# EAGLE design relais platine v7 (EAGLE 6.1)
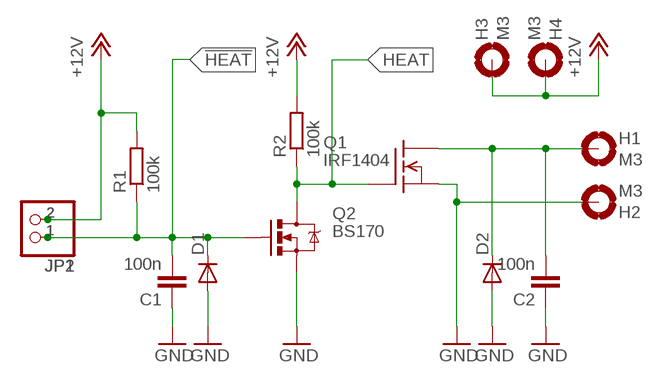
[diagram p0: schematic, sheet 1]

## Parts
C1  100n  C-EUC0805K  [C0805K]
C2  100n  C-EUC0805K  [C0805K]
D1  DIODE-MINIMELF  [MINIMELF]
D2  DIODE-MINIMELF  [MINIMELF]
H1  M3  MOUNT-PAD-ROUND3.0  [3,0-PAD]
H2  M3  MOUNT-PAD-ROUND3.0  [3,0-PAD]
H3  M3  MOUNT-PAD-ROUND3.0  [3,0-PAD]
H4  M3  MOUNT-PAD-ROUND3.0  [3,0-PAD]
JP1  PINHD-1X2  [1X02]
JP2  PINHD-1X2/90  [1X02/90]
Q1  IRF1404  IRF540  [TO220]
Q2  BS170  MOSFET-NCHANNELBSS123LT1G  [SOT23-3]
R1  100k  R-EU_M0805  [M0805]
R2  100k  R-EU_M0805  [M0805]

## Nets
!HEAT: C1.2 D1.C JP1.1 JP2.1 Q2.1(G) R1.1
+12V: H3.B3,0(MOUNT) H4.B3,0(MOUNT) JP1.2 JP2.2 R1.2 R2.2
GND: C1.1 C2.1 D1.A D2.A H2.B3,0(MOUNT) Q1.3(S) Q2.2(S)
HEAT: Q1.1(G) Q2.3(D) R2.1
HIGH: C2.2 D2.C H1.B3,0(MOUNT) Q1.2(D)

## Library data of the parts
C1 C2 = rcl:C-EU: CAPACITOR, European symbol
D1 D2 = diode:DIODE-: DIODE
H1-H4 = holes:MOUNT-PAD-ROUND: MOUNTING PAD, round
JP1 JP2 = pinhead:PINHD-1X2: PIN HEADER
Q1 = transistor-fet:IRF540: N-Channel Enhancement MOSFET (HEXFET); 100V; 28A; 0,077Ohm
Q2 = SparkFun-DiscreteSemi:MOSFET-NCHANNEL: Common NMOSFET Parts MFG P/N Store ID Prod ID FDD8780 TRANS-09984 SI7820DN TRANS-11055 FDS6630A IC-08089 2N7002PW TRANS-11151 FQP30N06L COM-10213 TRANS-10060 BSS123LT1G TRANS-08345 BSS138 TRANS-00830 BS170 2N7000; PROD_ID: TRANS-08345
R1 R2 = rcl:R-EU_: RESISTOR, European symbol

## Board
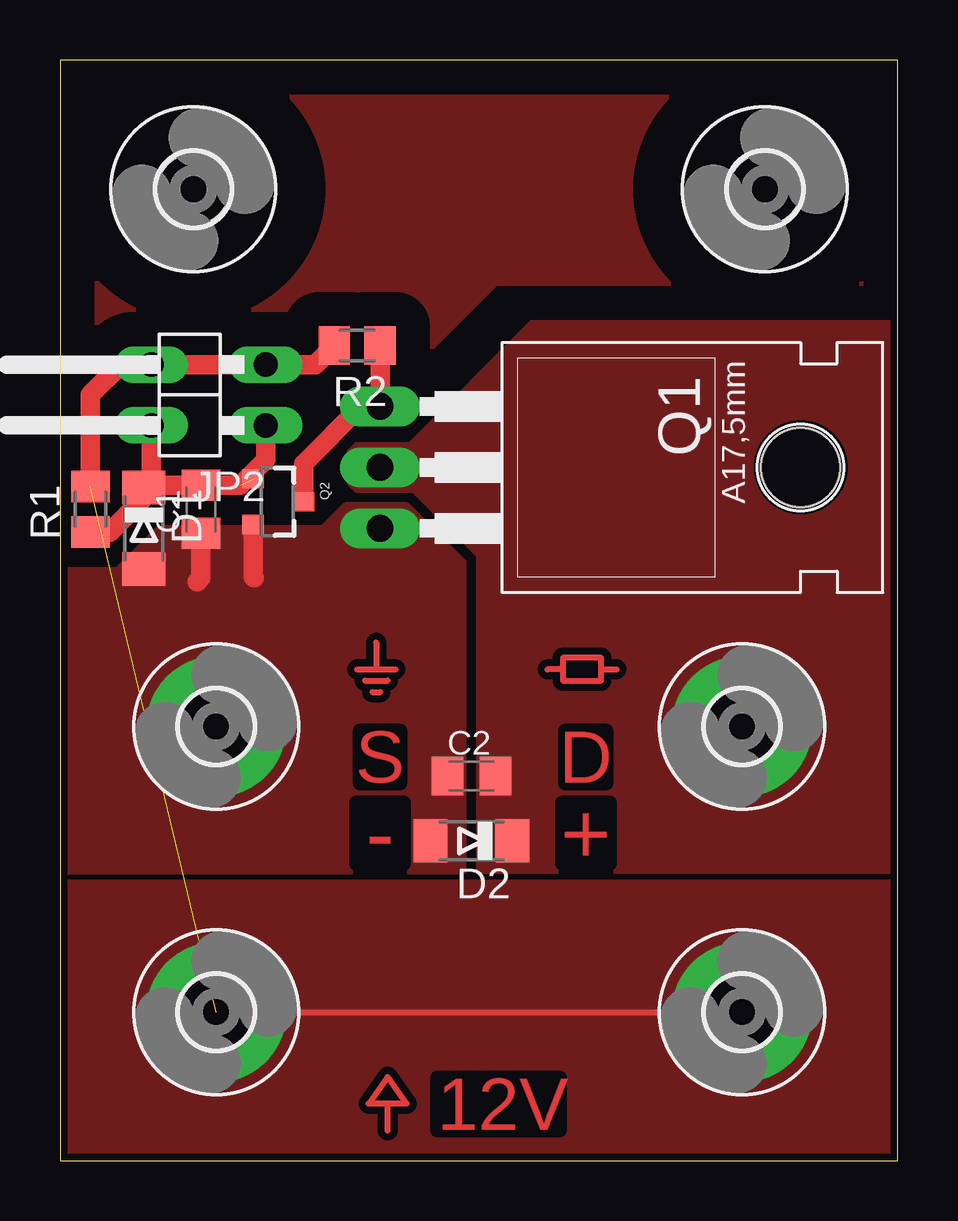
[diagram p1: board, top side]
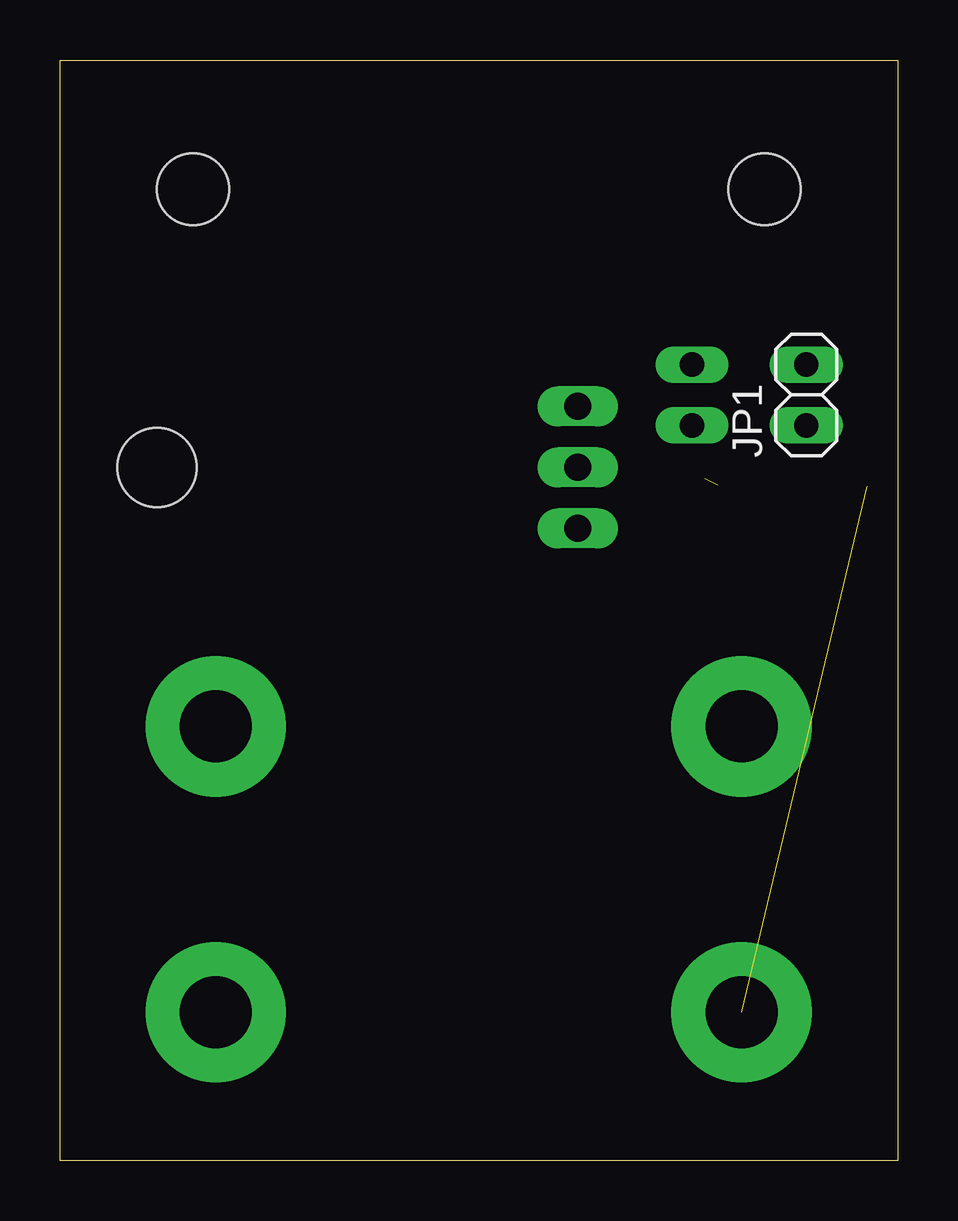
[diagram p2: board, bottom side, seen from below]

Size 34.91 x 45.87 mm. Coordinates in mm from the lower left corner, seen from the top.
Outline: 0,0 34.91,0 34.91,45.87 0,45.87 0,0
Copper layers (1*16): Top 0.035mm / dielectric 1.5mm / Bottom 0.035mm
Design rules: minimum track width 10mil, minimum drill 24mil, track to track 12mil, track to pad 12mil, pad to pad 12mil, via to via 12mil, smd to smd 10mil, copper to edge 12mil, drill to drill 12mil, minimum pad ring 10mil, minimum via ring 10mil, stop-mask expansion 4mil, vias tented up to drill 0mil, thermal gap 12mil

### Footprints (pad centres in the part's own frame; a part is rotated, then mirrored left to right if it is on the bottom)
C0805K = smd 1.3 x 1.6: 1 -1,0; 2 1,0
MINIMELF = smd 1.4 x 1.8: A 1.7,0; C -1.7,0
3,0-PAD = drill 3 pad 5.842: B3,0 0,0
1X02 = drill 1.016 long: 1 -1.27,0; 2 1.27,0
1X02/90 = drill 1.016 long: 1 -1.27,-3.81; 2 1.27,-3.81
TO220 = drill 1.118 long: 1 -2.54,-6.35; 2 0,-6.35; 3 2.54,-6.35 | hole 3.302: 0,11.176
SOT23-3 = smd 0.8 x 0.9: 1 -0.95,-1; 2 0.95,-1; 3 0,1.1
M0805 = smd 1.3 x 1.6: 1 -0.95,0; 2 0.95,0
3,0 = hole 3: 0,0

### Placement (x,y rotation side)
C1  5.87,27.15 90 top
C2  17.14,16.03 0 top
D1  3.49,26.35 270 top
D2  17.14,13.34 180 top
H1  28.42,18.1 0 top
H2  6.51,18.1 0 top
H3  28.42,6.19 0 top
H4  6.51,6.19 0 top
JP1  3.81,31.91 90 bottom
JP2  4.76,31.91 90 top
Q1  19.68,28.89 270 top
Q2  9.05,27.46 270 top
R1  1.27,27.15 90 top
R2  12.38,33.97 180 top
U$1  [3,0]  29.37,40.48 0 top
U$2  [3,0]  5.56,40.48 0 top

### Tracks (layer width: path | path; a pad name or v marks a point on that pad's centre or on a via)
!HEAT  (1 unrouted)
  Top 0.813: R1.1 2.07,26.2 3.49,27.62 D1.C | D1.C 3.49,28.1 | D1.C 3.59,28.15 C1.2 7.51,28.15 8.57,29.21 JP2.1 | JP1.1 3.81,28.37 D1.C
+12V  (1 unrouted)
  Top 0.254: H4.B3,0 H3.B3,0
  Top 0.813: R1.2 1.27,31.91 2.54,33.18 JP1.2 JP2.2 10.64,33.18 R2.2
  pour Top (isolate 0.254, no thermals): 0,0 34.92,0 34.92,11.59 0,11.59
GND
  Top 0.813: C1.1 5.87,24.29 5.71,24.13 | Q2.2 8.05,24.34 8.1,24.29
  pour Top (no thermals): 14.45,27.3 11.91,27.3 10.95,26.35 4.13,26.35 2.38,24.61 0,24.61 0,12.06 16.83,12.06 16.83,24.92
HEAT
  Top 0.813: Q2.3 10.15,29.04 12.54,31.43 Q1.1 R2.1
HIGH
  pour Top (no thermals): 17.46,12.06 17.46,25.24 14.76,27.94 12.38,27.94 12.06,28.26 12.06,29.53 12.38,29.84 14.61,29.84 19.68,34.92 34.92,34.92 34.92,12.06
N$1
  pour Top (isolate 1.422, rank 2, no thermals): 0,24.92 34.92,24.92 34.92,45.88 0,45.88
N$2
  Top 0.254: 13.65,1.27 13.65,2.38
N$3
  Top 0.254: 13.18,21.59 13.18,20.48
N$4
  Top 0.254: 12.38,20.48 13.97,20.48
N$5
  Top 0.254: 12.7,20 13.65,20
N$6
  Top 0.254: 13.02,19.53 13.34,19.53
N$7
  Top 0.254: 22.54,20.48 22.54,20 20.95,20 20.95,20.48 | 22.54,20.48 22.54,20.95 20.95,20.95 20.95,20.48 | 20.95,20.48 20.32,20.48 | 22.54,20.48 23.18,20.48
N$8
  Top 0.254: 14.45,2.38 12.86,2.38 13.65,3.49 14.45,2.38

### Text on the board
Top: S | D | - | + | 12V